# Altium schematic sheet Title.SchDoc: Title Sheet
size Letter; Date: 2017-02-17; Revision: A; SheetNumber: 1; SheetTotal: 11; ProjectTitle: PDUv17: Power Distribution Unit
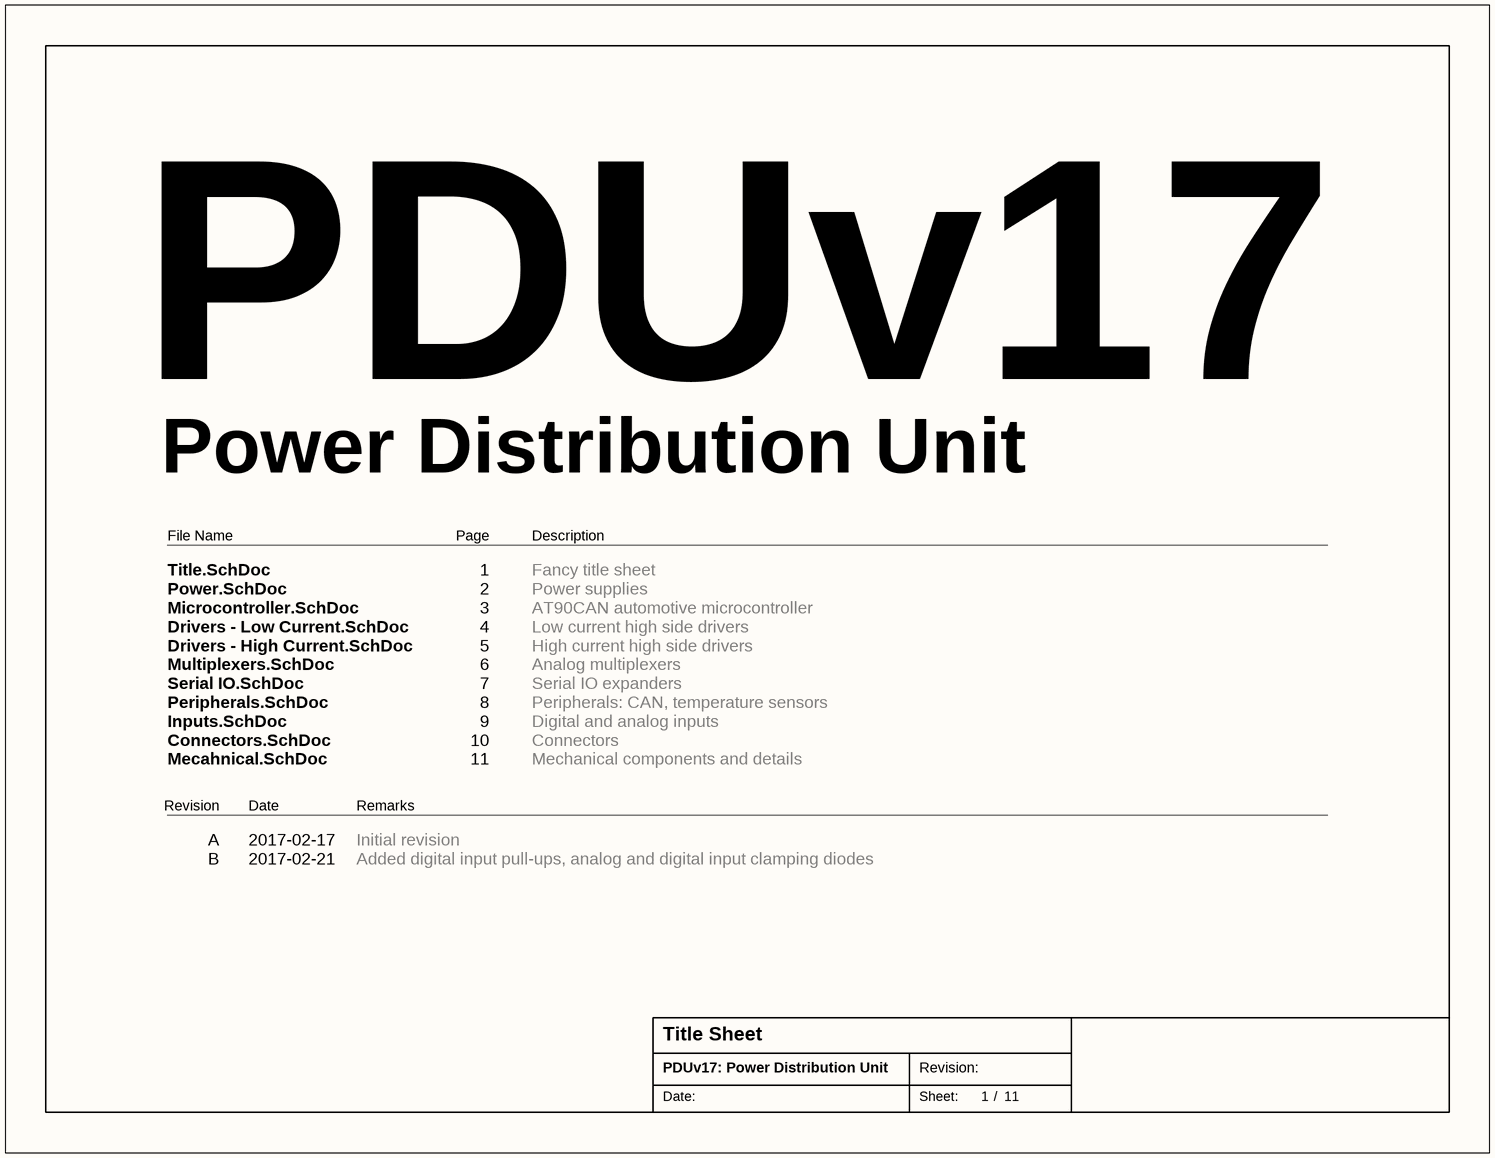
[diagram p0: Title.SchDoc]

## Notes on the sheet
- PDUv17
- Power Distribution Unit
- File Name
- Page
- Description
- Title.SchDoc
  Power.SchDoc
  Microcontroller.SchDoc
  Drivers - Low Current.SchDoc
  Drivers - High Current.SchDoc
  Multiplexers.SchDoc
  Serial IO.SchDoc
  Peripherals.SchDoc
  Inputs.SchDoc
  Connectors.SchDoc
  Mecahnical.SchDoc
- 1
  2
  3
  4
  5
  6
  7
  8
  9
  10
  11
- Fancy title sheet
  Power supplies
  AT90CAN automotive microcontroller
  Low current high side drivers
  High current high side drivers
  Analog multiplexers
  Serial IO expanders
  Peripherals: CAN, temperature sensors
  Digital and analog inputs
  Connectors
  Mechanical components and details
- Revision
- Date
- Remarks
- A
  B
- 2017-02-17
  2017-02-21
- Initial revision
  Added digital input pull-ups, analog and digital input clamping diodes
- Date:
- Revision:
- Sheet:
- /